# Altium schematic sheet 05. 4G Module.SchDoc
size A3
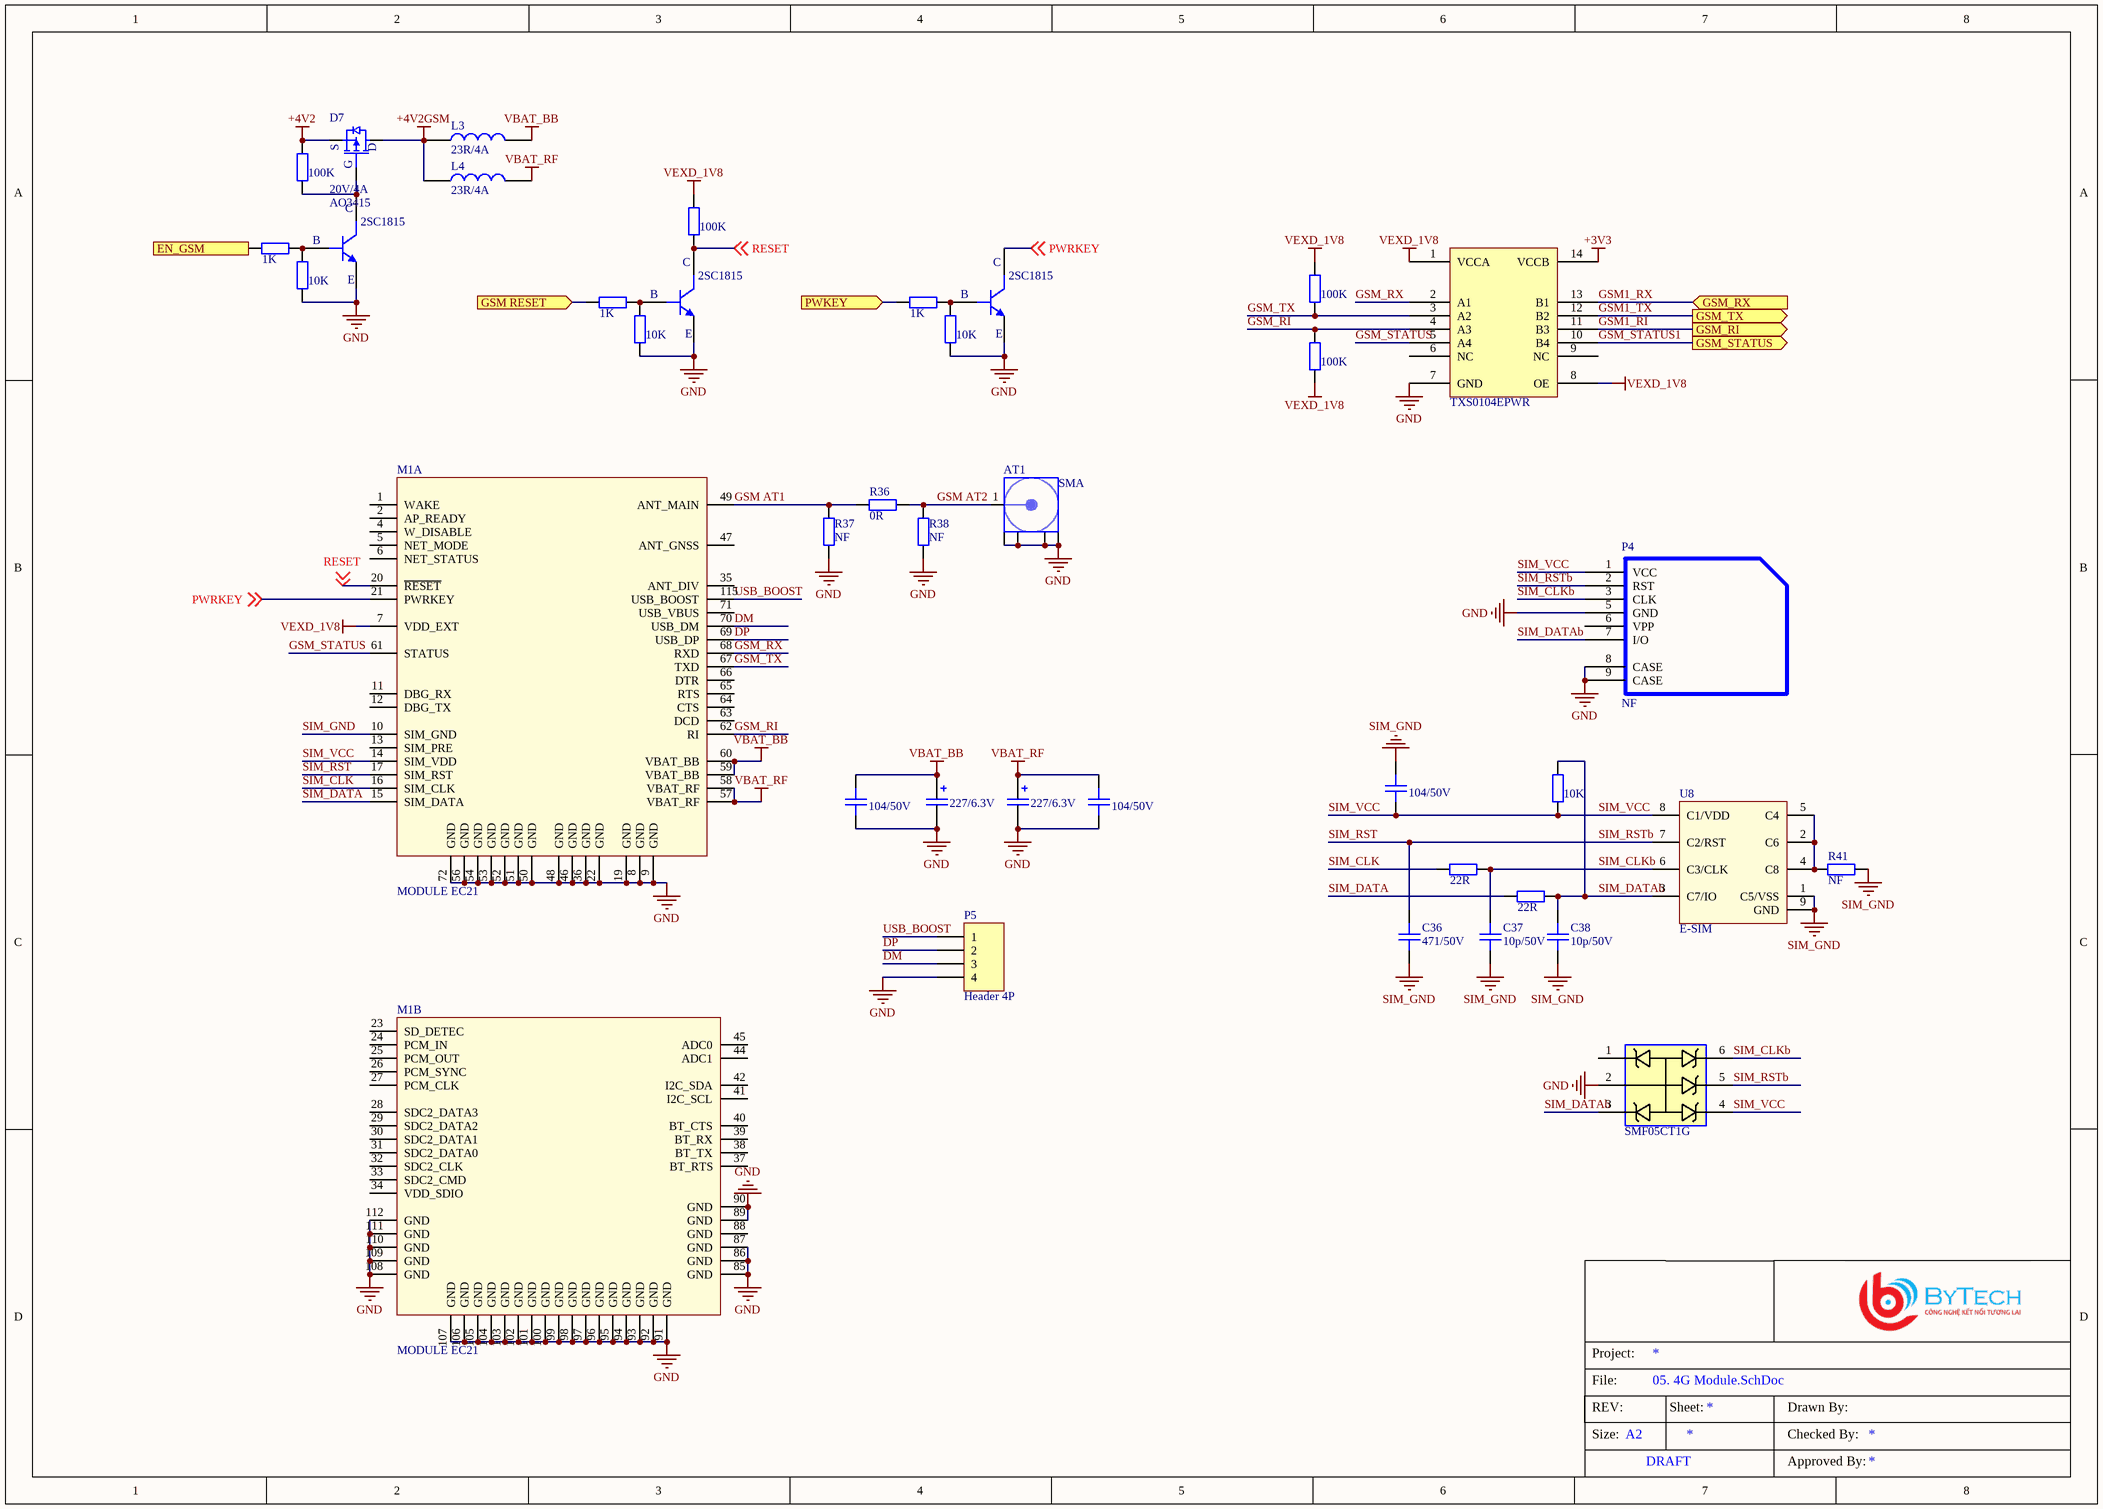
[diagram p0: 05. 4G Module.SchDoc]

## Parts
AT1  SMA  [SMA-KWE-17-V1]
C31  104/50V  [CAPC-0603 (1608)]
C32  227/6.3V  [CAP_TANTAL_1210(3528)]
C33  227/6.3V  [CAP_TANTAL_1210(3528)]
C34  104/50V  [CAPC-0603 (1608)]
C35  104/50V  [CAPC-0603 (1608)]
C36  471/50V  [CAPC-0603 (1608)]
C37  10p/50V  [CAPC-0603 (1608)]
C38  10p/50V  [CAPC-0603 (1608)]
D7  20V/4A  [SOT23_3]
L3  23R/4A  [IND-0603 (1608)]
L4  23R/4A  [IND-0603 (1608)]
M1  MODULE EC21  [EC21]  (parts A,B of 3)
P4  NF  [MUP-C792]
P5  Header 4P  [HDR1X4]
Q2  2SC1815  [SOT23_3]
Q3  2SC1815  [SOT23_3]
Q4  2SC1815  [SOT23_3]
R26  100K  [RESC-0603 (1608)]
R27  100K  [RESC-0603 (1608)]
R28  1K  [RESC-0603 (1608)]
R29  10K  [RESC-0603 (1608)]
R30  100K  [RESC-0603 (1608)]
R31  1K  [RESC-0603 (1608)]
R32  1K  [RESC-0603 (1608)]
R33  10K  [RESC-0603 (1608)]
R34  10K  [RESC-0603 (1608)]
R35  100K  [RESC-0603 (1608)]
R36  0R  [RESC-0603 (1608)]
R37  NF  [RESC-0603 (1608)]
R38  NF  [RESC-0603 (1608)]
R39  10K  [RESC-0603 (1608)]
R40  22R  [RESC-0603 (1608)]
R41  NF  [RESC-0603 (1608)]
R42  22R  [RESC-0603 (1608)]
U7  TXS0104EPWR  [TSOP65P640X120-14N]
U8  E-SIM  [MFF2 ESIM]
U9  SMF05CT1G  [SOT363]

## Ports
EN_GSM (in), GSM RESET (in), GSM_RI (out), GSM_RX (in), GSM_STATUS (out), GSM_TX (out), PWKEY (in)

## Nets
+3V3: U7.14(VCCB)
+4V2: D7.2(S) R26.2
+4V2GSM: D7.3(D) L3.1 L4.1
GND: AT1.2 C32.2 C33.2 C34.2 C35.2 M1.8(GND) M1.9(GND) M1.19(GND) M1.22(GND) M1.36(GND) M1.46(GND) M1.48(GND) M1.50(GND) M1.51(GND) M1.52(GND) M1.53(GND) M1.54(GND) M1.56(GND) M1.72(GND) M1.85(GND) M1.86(GND) M1.87(GND) M1.89(GND) M1.90(GND) M1.91(GND) M1.92(GND) M1.93(GND) M1.94(GND) M1.95(GND) M1.96(GND) M1.97(GND) M1.98(GND) M1.99(GND) M1.100(GND) M1.101(GND) M1.102(GND) M1.103(GND) M1.104(GND) M1.105(GND) M1.106(GND) M1.107(GND) M1.108(GND) M1.109(GND) M1.110(GND) M1.111(GND) M1.112(GND) P4.5(GND) P4.8(CASE) P4.9(CASE) P5.4 Q2.2(E) Q3.2(E) Q4.2(E) R29.1 R33.1 R34.1 R37.1 R38.1 U7.7(GND) U9.2(AN)
SIM_GND: C31.1 C36.1 C37.1 C38.1 M1.10(SIM_GND) R41.2 U8.1(C5/VSS) U8.9(GND)
VBAT_BB: C32.1 C34.1 L3.2 M1.59(VBAT_BB) M1.60(VBAT_BB)
VBAT_RF: C33.1 C35.1 L4.2 M1.57(VBAT_RF) M1.58(VBAT_RF)
VEXD_1V8: M1.7(VDD_EXT) R27.2 R30.2 R35.2 U7.1(VCCA) U7.8(OE)
DM: M1.70(USB_DM) P5.3
DP: M1.69(USB_DP) P5.2
EN_GSM: R28.1 ; port EN_GSM
GSM1_RI: U7.11(B3) ; port GSM_RI
GSM1_RX: U7.13(B1) ; port GSM_RX
GSM1_TX: U7.12(B2) ; port GSM_TX
GSM AT1: M1.49(ANT_MAIN) R36.1 R37.2
GSM AT2: AT1.1(Signal) R36.2 R38.2
GSM RESET: R31.1 ; port GSM RESET
GSM_RI: M1.62(RI) R35.1 U7.4(A3)
GSM_RX: M1.68(RXD) U7.2(A1)
GSM_STATUS: M1.61(STATUS) U7.5(A4)
GSM_STATUS1: U7.10(B4) ; port GSM_STATUS
GSM_TX: M1.67(TXD) R30.1 U7.3(A2)
PWKEY: R32.1 ; port PWKEY
PWRKEY: M1.21(PWRKEY) Q4.3(C) ; off-sheet PWRKEY
RESET: M1.20(~{RESET}) Q3.3(C) R27.1 ; off-sheet RESET
SIM_CLK: M1.16(SIM_CLK) R40.1
SIM_CLKb: C37.2 P4.3(CLK) R40.2 U8.6(C3/CLK) U9.6(CT5)
SIM_DATA: M1.15(SIM_DATA) R42.1
SIM_DATAb: C38.2 P4.7(I/O) R39.2 R42.2 U8.3(C7/IO) U9.3(CT2)
SIM_RST: C36.2 M1.17(SIM_RST) P4.2(RST) U8.7(C2/RST) U9.5(CT4)  [also labelled SIM_RSTb]
SIM_VCC: C31.2 M1.14(SIM_VDD) P4.1(VCC) R39.1 U8.8(C1/VDD) U9.4(CT3)
USB_BOOST: M1.115(USB_BOOST) P5.1
NetD7_1: D7.1(G) Q2.3(C) R26.1
NetQ2_1: Q2.1(B) R28.2 R29.2
NetQ3_1: Q3.1(B) R31.2 R33.2
NetQ4_1: Q4.1(B) R32.2 R34.2
NetR41_1: R41.1 U8.2(C6) U8.4(C8) U8.5(C4)

Not connected (* = marked no-connect by the designer): M1 1(WAKE) 2(AP_READY) 4(W_DISABLE) 5(NET_MODE) 6(NET_STATUS) 11(DBG_RX) 12(DBG_TX) 13(SIM_PRE) 23(SD_DETEC) 24(PCM_IN) 25(PCM_OUT) 26(PCM_SYNC) 27(PCM_CLK) 28(SDC2_DATA3) 29(SDC2_DATA2) 30(SDC2_DATA1) 31(SDC2_DATA0) 32(SDC2_CLK) 33(SDC2_CMD) 34(VDD_SDIO) 35(ANT_DIV) 37(BT_RTS) 38(BT_TX) 39(BT_RX) 40(BT_CTS) 41(I2C_SCL) 42(I2C_SDA) 44(ADC1) 45(ADC0) 47(ANT_GNSS) 63(DCD) 64(CTS) 65(RTS) 66(DTR) 71(USB_VBUS) 88(GND); P4 6(VPP); U7 6(NC) 9(NC); U9 1(CT1)

## Notes on the sheet
- File:
- Project:
- REV:
- Size:
- A2
- Sheet:
- Drawn By:
- Checked By:
- DRAFT
- Approved By:

## Library data of the parts
AT1 = GKZS-SMAJZM-KWE-17.3: MFR: GAOKE; Solder: WAVE; MPN: GKZS-SMAJZM-KWE-17.3; Value: SMA
C31 C34 C35 = C0603C104K5RACTU: CAP CER 0.1uF 50V 10% X7R 0603; CompanyID: VT-00982; Solder: SMT; MPN: C0603C104K5RACTU; Value: 104/50V
C32 C33 = T520B227M006ATE035: CAP TANT POLY 220uF 20% 6.3V 3528 35mOhm ESR; Solder: SMT; CompanyID: VT-00643; Value: 227/6.3V; MPN: T520B227M006ATE035
C36 = CL10B471KB8NNNC: CAP CER 470pF 10% 50V X7R 0603; Solder: SMT; Company ID: VT00072; MPN: CL10B471KB8NNNC; Value: 471/50V
C37 C38 = CL10C100JB8NNND: CAP CER 10pF 5% 50V NP0 0603; Solder: SMT; Company ID: VT00076; Value: 10p/50V; MPN: CL10C100JB8NNND
D7 = AO3415: MOSFET P-CH 20V 4A SOT23; MFR: Alpha & Omega Semiconductor Inc.; Company ID: VT00490; CATEGORY: DIODE; SOLDER: SOT23; VALUE: 20V/4A; MPN: AO3415
L3 L4 = FBMJ1608HM230NT: IND-FERRITE BEAD 23 OHM  4A 0603 1LN; Solder: SMT; Company ID: VT00326; MPN: FBMJ1608HM230NT; Value: 23R/4A
M1 = QUECTEL EC21: Quectel EC21 is a series of LTE category; MPN: EC21-CN; SOLDER: SMT; MFR: QUECTEL; CATEGORY: IC
P4 = MUP-C792: MicroSIM Card Push - Push Holder; MFR: MUPCONNECTOR; Company ID: VT00135; Solder: SMT; MPN: MUP-C792; Value: MUP-C792
P5 = Header 4x1: Header, 4 Pin Pitch 2.54mm; MPN: S1012EC-40-ND; Company ID: VT-00125; Solder: WAVE; Value: Header 4P
Q2-Q4 = 2SC1815: TRANS NPN 50V 0.15A SOT23-3; Solder: SMT; MPN: 2SC1815; Value: 2SC1815
R26 R27 R30 R35 = RC0603FR-07100KL: RES SMD 100K OHM 1% 1/10W 0603; CompanyID: VT-00332; Solder: SMT; MPN: RC0603FR-07100KL; Value: 100K
R28 R31 R32 = RC0603FR-071KL: RES SMD 1 KOHM 1% 1/10W 0603; CompanyID: VT-00574; Solder: SMT; MPN: RC0603FR-071KL; Value: 1K
R29 R33 R34 R39 = RC0603FR-0710KL: RES SMD 10K OHM 1% 1/10W 0603; CompanyID: VT-00328; Solder: SMT; MPN: RC0603FR-0710KL; Value: 10K
R36 = RC0603FR-070R: RES SMD 0 OHM 1% 1/10W 0603; Solder: SMT; Company ID: VT00423; Value: 0R; MPN: RC0603FR-070R
R37 R38 R41 = RC0603FR-070R: RES SMD 0 OHM 1% 1/10W 0603; Solder: SMT; Value: 0R; Company ID: VT00423; MPN: RC0603FR-070R
R40 R42 = RC0603FR-0722RL: RES SMD 22 OHM 1% 1/10W 0603; CompanyID: VT-00881; Solder: SMT; Value: 22R; MPN: RC0603FR-0722RL
U7 = TXS0104EPWR: IC 4BIT NON-INV TRANSLTR 14TSSOP; Solder: SMT; Value: TXS0104EPWR; MPN: TXS0104EPWR; Category: IC
U8 = SCM512: M2M communication module e-sim; MFR: ATC; SOLDER: WSON-8; MPN: SCM512; CATEGORY: IC; Value: E-SIM
U9 = SMF05CT1G: TVS DIODE 5VWM 12.5VC SC88; CompanyID: VT-00105; Solder: SMT; MPN: SMF05CT1G; Value: SMF05CT1G